# Altium project mb1260.PrjPCB (part 1 of 3)
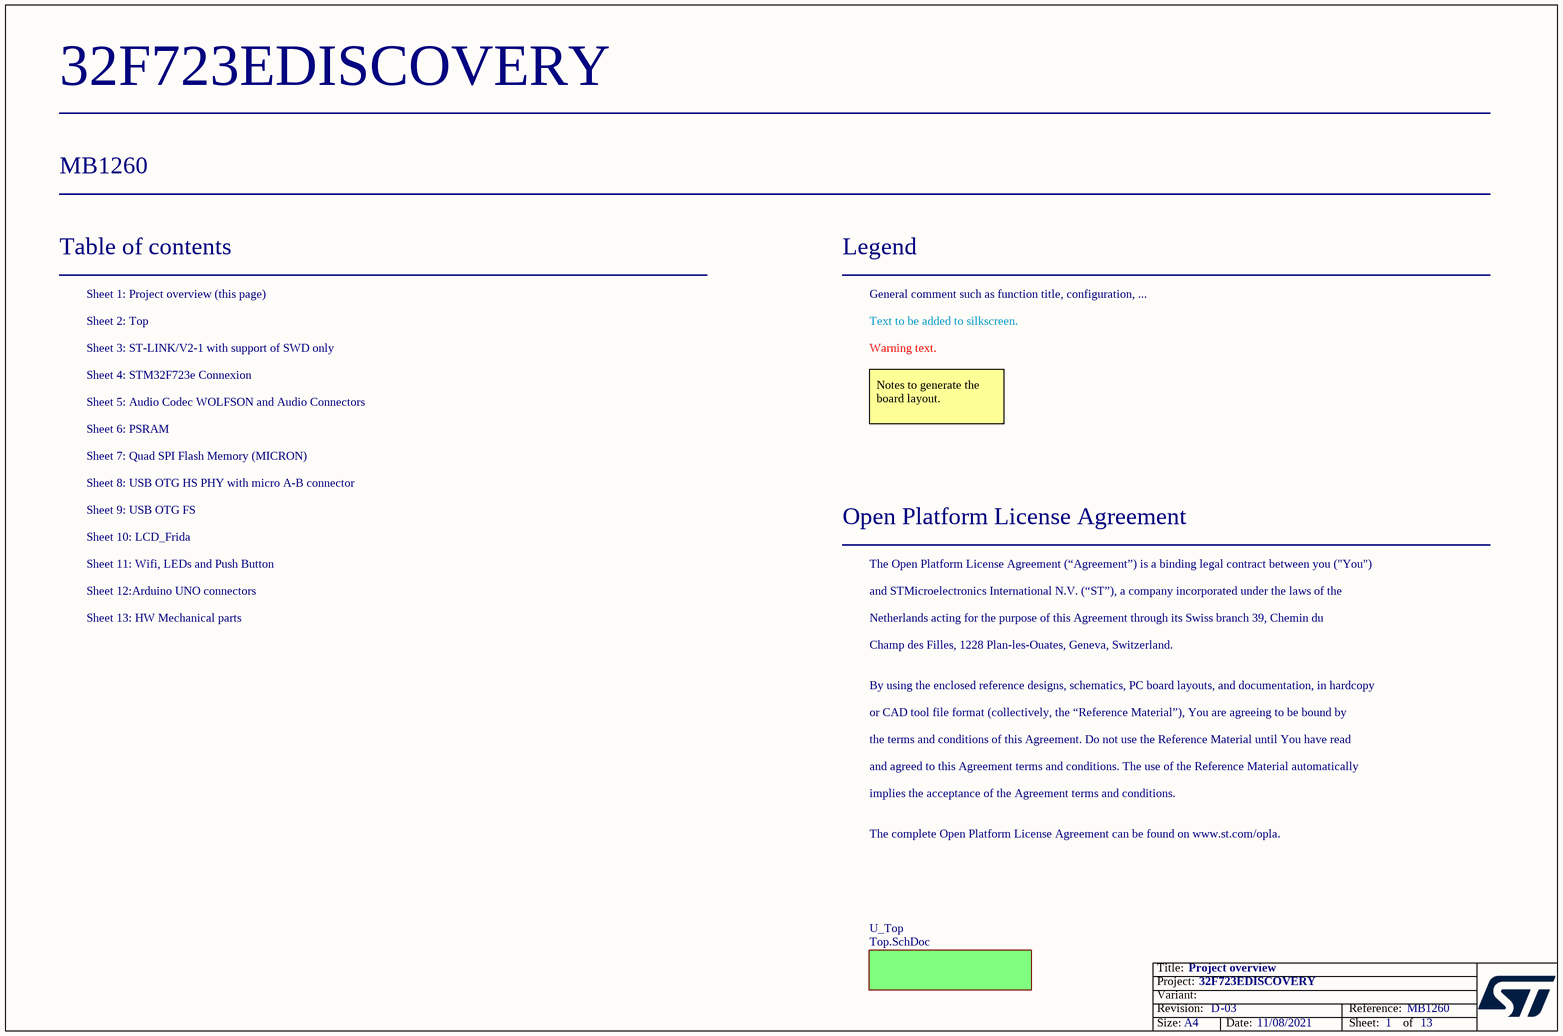
[diagram p0: Project_Overview.SchDoc]
Board_Assembly_revision: 03; Board_Document_Date: 11/08/2021; Board_name: 32F723EDISCOVERY; Board_PCB_Revision: D; Board_Reference: MB1260; BOMRevision: D-03; PCBRevision: D-03
13 sheets, 312 parts. Net scope: flat (ports and power ports of the same name join across sheets).
Board file: mb1260.PcbDoc
Sheets:
  Project_Overview.SchDoc
    U_Top = Top.SchDoc
      U_ST_LINK_V2-1 = ST_LINK_V2-1.SCHDOC
      U_AUDIO = AUDIO.SchDoc
      U_Peripherals = Peripherals.SchDoc
      U_Arduino_ Connectors = ARDUINO.SchDoc
      U_PSRAM = PSRAM.SchDoc
      U_USB_OTG_FS = USB_OTG_FS.SchDoc
      U_STM32F7 = STM32F7.SchDoc
      U_LCD_FRIDA = LCD_FRIDA.SchDoc
      U_USB_OTG_HS = USB_OTG_HS.SchDoc
      U_QSPI = QSPI.SchDoc
      U_HW_Mechanical_Parts = HW_Mechanical_Parts.SchDoc

## Sheet Project_Overview.SchDoc: Project overview
size A4; Date: Not used; ApprovedBy: Not used; CheckedBy: Not used; Author: Not used; CompanyName: STMicroelectronics; DrawnBy: Not used; Engineer: Not used; Organization: Not used; Address1: Not used; Address2: Not used; Address3: Not used; Address4: Not used; DocumentNumber: MB1260; Revision: Not used; SheetNumber: 1; SheetTotal: 13; CurrentTime: Not used; CurrentDate: Not used; Time: Not used; DocumentFullPathAndName: Not used; DocumentName: Not used; ModifiedDate: Not used; ImagePath: Not used; ProjectName: Not used; Application_BuildNumber: Not used

### Sub-sheets
U_Top = Top.SchDoc: no entries

### Notes on the sheet
- Table of contents
- Sheet 1: Project overview (this page)
- Legend
- General comment such as function title, configuration, ...
- Sheet 2: Top
- Sheet 3: ST-LINK/V2-1 with support of SWD only
- Sheet 4: STM32F723e Connexion
- Text to be added to silkscreen.
- Warning text.
- Sheet 6: PSRAM
- Sheet 5: Audio Codec WOLFSON and Audio Connectors
- Notes to generate the board layout.
- Sheet 7: Quad SPI Flash Memory (MICRON)
- Sheet 9: USB OTG FS
- Sheet 8: USB OTG HS PHY with micro A-B connector
- Sheet 10: LCD_Frida
- Sheet 11: Wifi, LEDs and Push Button
- Open Platform License Agreement
- The Open Platform License Agreement (“Agreement”) is a binding legal contract between you ("You")
- Sheet 13: HW Mechanical parts
- Sheet 12:Arduino UNO connectors
- and STMicroelectronics International N.V. (“ST”), a company incorporated under the laws of the
- Netherlands acting for the purpose of this Agreement through its Swiss branch 39, Chemin du
- Champ des Filles, 1228 Plan-les-Ouates, Geneva, Switzerland.
- By using the enclosed reference designs, schematics, PC board layouts, and documentation, in hardcopy
- or CAD tool file format (collectively, the “Reference Material”), You are agreeing to be bound by
- the terms and conditions of this Agreement. Do not use the Reference Material until You have read
- and agreed to this Agreement terms and conditions. The use of the Reference Material automatically
- implies the acceptance of the Agreement terms and conditions.
- The complete Open Platform License Agreement can be found on www.st.com/opla.
- Title:
- Project:
- Size:
- Revision:
- Variant:
- A4
- -
- Date:
- Reference:
- Sheet:
- of

## Sheet Top.SchDoc: STM32F723e Discovery Interconnexion
size A4; Author: N.P; CompanyName: STMicroelectronics; Organization: MCD/APPLIS/LMS; DocumentNumber: MB1260; Revision: D-03; SheetNumber: 2; SheetTotal: 13; Project: STM32F723e-DISCO; BOM Version: D-03
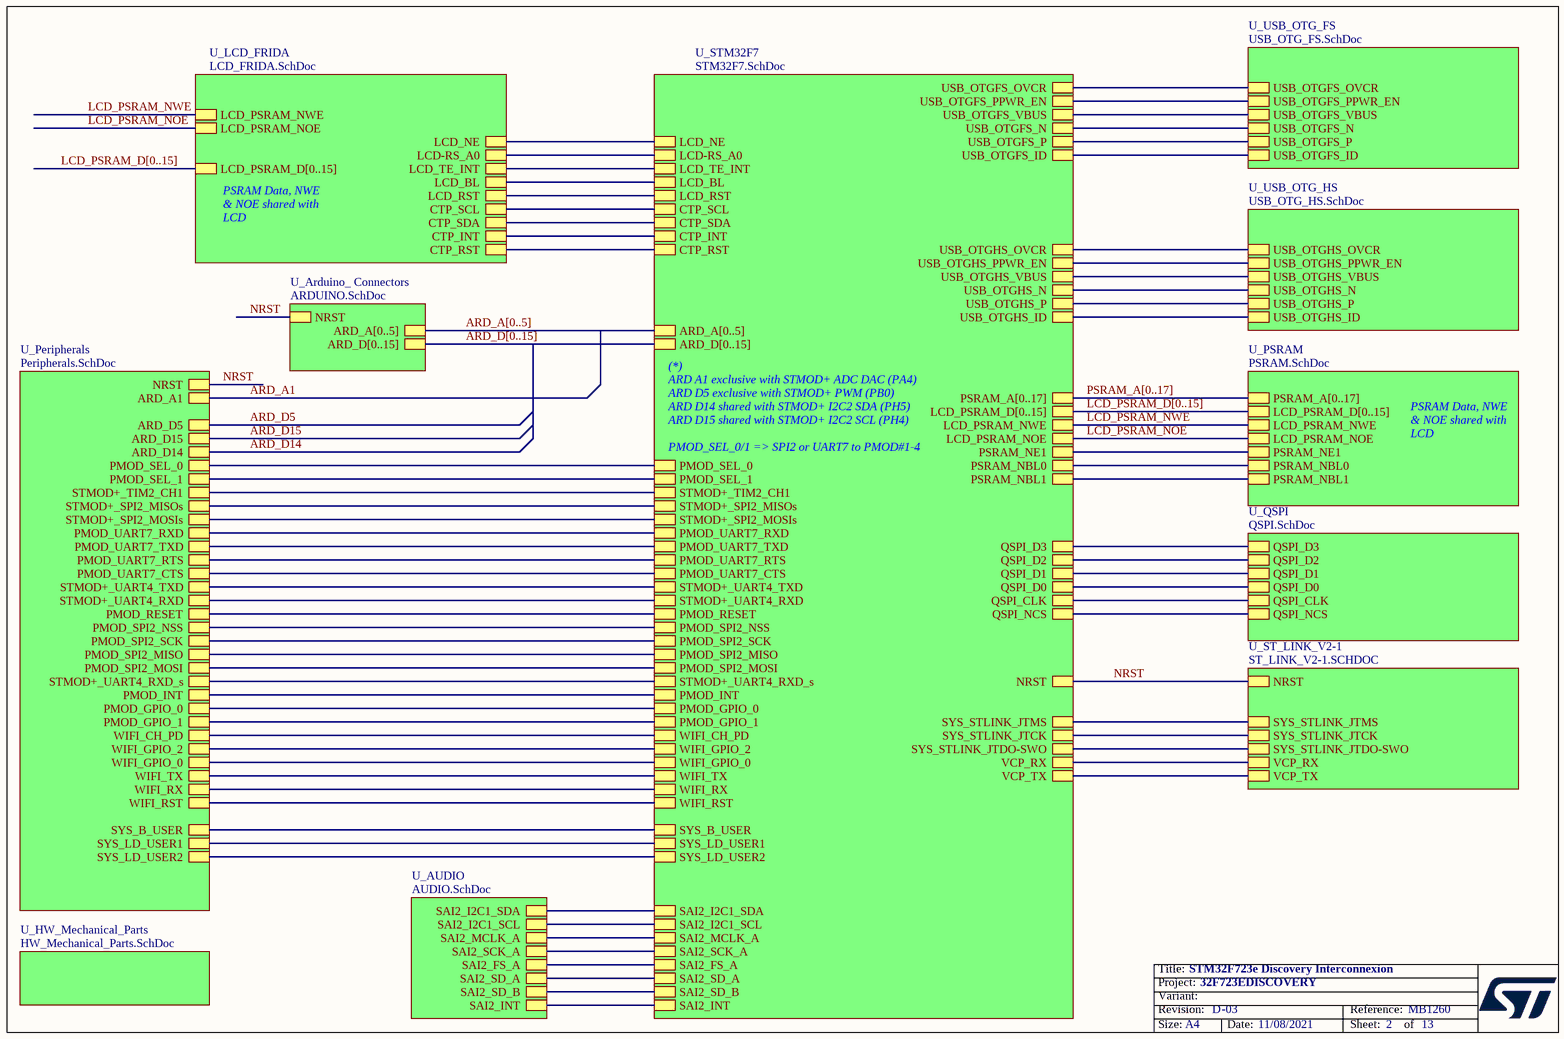
[diagram p1: Top.SchDoc]

### Sub-sheets
U_Arduino_ Connectors = ARDUINO.SchDoc: NRST, ARD_D[0..15], ARD_A[0..5]
U_AUDIO = AUDIO.SchDoc: SAI2_I2C1_SDA, SAI2_I2C1_SCL, SAI2_MCLK_A, SAI2_SCK_A, SAI2_FS_A, SAI2_SD_A, SAI2_SD_B, SAI2_INT
U_HW_Mechanical_Parts = HW_Mechanical_Parts.SchDoc: no entries
U_LCD_FRIDA = LCD_FRIDA.SchDoc: LCD_NE, LCD_TE_INT, LCD_BL, LCD_RST, CTP_SCL, CTP_SDA, CTP_INT, CTP_RST, LCD_PSRAM_D[0..15], LCD_PSRAM_NWE, LCD_PSRAM_NOE, LCD-RS_A0
U_Peripherals = Peripherals.SchDoc: NRST, WIFI_TX, WIFI_RX, WIFI_RST, STMOD+_TIM2_CH1, STMOD+_SPI2_MOSIs, PMOD_UART7_RXD, PMOD_UART7_TXD, PMOD_UART7_CTS, PMOD_UART7_RTS, STMOD+_UART4_TXD, STMOD+_UART4_RXD, PMOD_RESET, PMOD_SPI2_SCK, PMOD_SPI2_NSS, PMOD_SPI2_MISO, PMOD_SPI2_MOSI, STMOD+_UART4_RXD_s, PMOD_INT, SYS_B_USER, SYS_LD_USER1, SYS_LD_USER2, ARD_D15, ARD_D14, ARD_A1, ARD_D5, PMOD_GPIO_1, PMOD_GPIO_0, WIFI_GPIO_0, WIFI_GPIO_2, WIFI_CH_PD, PMOD_SEL_1, STMOD+_SPI2_MISOs, PMOD_SEL_0
U_PSRAM = PSRAM.SchDoc: PSRAM_A[0..17], LCD_PSRAM_D[0..15], LCD_PSRAM_NWE, PSRAM_NE1, PSRAM_NBL0, PSRAM_NBL1, LCD_PSRAM_NOE
U_QSPI = QSPI.SchDoc: QSPI_D0, QSPI_D3, QSPI_D1, QSPI_CLK, QSPI_NCS, QSPI_D2
U_ST_LINK_V2-1 = ST_LINK_V2-1.SCHDOC: SYS_STLINK_JTMS, SYS_STLINK_JTCK, SYS_STLINK_JTDO-SWO, VCP_RX, VCP_TX, NRST
U_STM32F7 = STM32F7.SchDoc: QSPI_D0, QSPI_D3, QSPI_D1, QSPI_CLK, QSPI_NCS, SAI2_I2C1_SDA, SAI2_I2C1_SCL, SAI2_MCLK_A, CTP_SCL, CTP_SDA, PSRAM_A[0..17], LCD_PSRAM_D[0..15], LCD_PSRAM_NWE, PSRAM_NE1, PSRAM_NBL0, PSRAM_NBL1, QSPI_D2, ARD_D[0..15], SAI2_SCK_A, SAI2_FS_A, SAI2_SD_A, SAI2_SD_B, SAI2_INT, LCD_NE, LCD_TE_INT, LCD_BL, LCD_RST, CTP_INT, CTP_RST, WIFI_RST, WIFI_RX, WIFI_TX, ARD_A[0..5], LCD_PSRAM_NOE, SYS_STLINK_JTMS, SYS_STLINK_JTCK, SYS_STLINK_JTDO-SWO, VCP_RX, VCP_TX, USB_OTGHS_OVCR, USB_OTGHS_PPWR_EN, USB_OTGHS_VBUS, USB_OTGHS_N, USB_OTGHS_ID, USB_OTGHS_P, USB_OTGFS_OVCR, USB_OTGFS_PPWR_EN, USB_OTGFS_VBUS, USB_OTGFS_P, USB_OTGFS_N, USB_OTGFS_ID, STMOD+_TIM2_CH1, STMOD+_SPI2_MOSIs, PMOD_UART7_RXD, PMOD_UART7_TXD, PMOD_UART7_CTS, PMOD_UART7_RTS, STMOD+_UART4_TXD, STMOD+_UART4_RXD, PMOD_RESET, PMOD_SPI2_SCK, PMOD_SPI2_NSS, PMOD_SPI2_MISO, PMOD_SPI2_MOSI, STMOD+_UART4_RXD_s, PMOD_INT, NRST, SYS_B_USER, SYS_LD_USER1, SYS_LD_USER2, PMOD_GPIO_0, PMOD_GPIO_1, WIFI_GPIO_0, WIFI_GPIO_2, WIFI_CH_PD, LCD-RS_A0, PMOD_SEL_1, STMOD+_SPI2_MISOs, PMOD_SEL_0
U_USB_OTG_FS = USB_OTG_FS.SchDoc: USB_OTGFS_OVCR, USB_OTGFS_PPWR_EN, USB_OTGFS_VBUS, USB_OTGFS_P, USB_OTGFS_N, USB_OTGFS_ID
U_USB_OTG_HS = USB_OTG_HS.SchDoc: USB_OTGHS_OVCR, USB_OTGHS_PPWR_EN, USB_OTGHS_VBUS, USB_OTGHS_N, USB_OTGHS_ID, USB_OTGHS_P

### Nets
ARD_A1: sheet U_Peripherals/ARD_A1
ARD_D5: sheet U_Peripherals/ARD_D5
ARD_D14: sheet U_Peripherals/ARD_D14
ARD_D15: sheet U_Peripherals/ARD_D15
LCD_PSRAM_NOE: sheet U_PSRAM/LCD_PSRAM_NOE, sheet U_STM32F7/LCD_PSRAM_NOE, sheet U_LCD_FRIDA/LCD_PSRAM_NOE
LCD_PSRAM_NWE: sheet U_PSRAM/LCD_PSRAM_NWE, sheet U_STM32F7/LCD_PSRAM_NWE, sheet U_LCD_FRIDA/LCD_PSRAM_NWE
NRST: sheet U_ST_LINK_V2-1/NRST, sheet U_Peripherals/NRST, sheet U_Arduino_ Connectors/NRST, sheet U_STM32F7/NRST
(unnamed): sheet U_ST_LINK_V2-1/SYS_STLINK_JTMS, sheet U_STM32F7/SYS_STLINK_JTMS
(unnamed): sheet U_ST_LINK_V2-1/SYS_STLINK_JTCK, sheet U_STM32F7/SYS_STLINK_JTCK
(unnamed): sheet U_ST_LINK_V2-1/SYS_STLINK_JTDO-SWO, sheet U_STM32F7/SYS_STLINK_JTDO-SWO
(unnamed): sheet U_ST_LINK_V2-1/VCP_RX, sheet U_STM32F7/VCP_RX
(unnamed): sheet U_ST_LINK_V2-1/VCP_TX, sheet U_STM32F7/VCP_TX
(unnamed): sheet U_AUDIO/SAI2_I2C1_SDA, sheet U_STM32F7/SAI2_I2C1_SDA
(unnamed): sheet U_AUDIO/SAI2_I2C1_SCL, sheet U_STM32F7/SAI2_I2C1_SCL
(unnamed): sheet U_AUDIO/SAI2_MCLK_A, sheet U_STM32F7/SAI2_MCLK_A
(unnamed): sheet U_AUDIO/SAI2_SCK_A, sheet U_STM32F7/SAI2_SCK_A
(unnamed): sheet U_AUDIO/SAI2_FS_A, sheet U_STM32F7/SAI2_FS_A
(unnamed): sheet U_AUDIO/SAI2_SD_A, sheet U_STM32F7/SAI2_SD_A
(unnamed): sheet U_AUDIO/SAI2_SD_B, sheet U_STM32F7/SAI2_SD_B
(unnamed): sheet U_AUDIO/SAI2_INT, sheet U_STM32F7/SAI2_INT
(unnamed): sheet U_Peripherals/WIFI_TX, sheet U_STM32F7/WIFI_TX
(unnamed): sheet U_Peripherals/WIFI_RX, sheet U_STM32F7/WIFI_RX
(unnamed): sheet U_Peripherals/WIFI_RST, sheet U_STM32F7/WIFI_RST
(unnamed): sheet U_Peripherals/STMOD+_TIM2_CH1, sheet U_STM32F7/STMOD+_TIM2_CH1
(unnamed): sheet U_Peripherals/STMOD+_SPI2_MOSIs, sheet U_STM32F7/STMOD+_SPI2_MOSIs
(unnamed): sheet U_Peripherals/PMOD_UART7_RXD, sheet U_STM32F7/PMOD_UART7_RXD
(unnamed): sheet U_Peripherals/PMOD_UART7_TXD, sheet U_STM32F7/PMOD_UART7_TXD
(unnamed): sheet U_Peripherals/PMOD_UART7_CTS, sheet U_STM32F7/PMOD_UART7_CTS
(unnamed): sheet U_Peripherals/PMOD_UART7_RTS, sheet U_STM32F7/PMOD_UART7_RTS
(unnamed): sheet U_Peripherals/STMOD+_UART4_TXD, sheet U_STM32F7/STMOD+_UART4_TXD
(unnamed): sheet U_Peripherals/STMOD+_UART4_RXD, sheet U_STM32F7/STMOD+_UART4_RXD
(unnamed): sheet U_Peripherals/PMOD_RESET, sheet U_STM32F7/PMOD_RESET
(unnamed): sheet U_Peripherals/PMOD_SPI2_SCK, sheet U_STM32F7/PMOD_SPI2_SCK
(unnamed): sheet U_Peripherals/PMOD_SPI2_NSS, sheet U_STM32F7/PMOD_SPI2_NSS
(unnamed): sheet U_Peripherals/PMOD_SPI2_MISO, sheet U_STM32F7/PMOD_SPI2_MISO
(unnamed): sheet U_Peripherals/PMOD_SPI2_MOSI, sheet U_STM32F7/PMOD_SPI2_MOSI
(unnamed): sheet U_Peripherals/STMOD+_UART4_RXD_s, sheet U_STM32F7/STMOD+_UART4_RXD_s
(unnamed): sheet U_Peripherals/PMOD_INT, sheet U_STM32F7/PMOD_INT
(unnamed): sheet U_Peripherals/SYS_B_USER, sheet U_STM32F7/SYS_B_USER
(unnamed): sheet U_Peripherals/SYS_LD_USER1, sheet U_STM32F7/SYS_LD_USER1
(unnamed): sheet U_Peripherals/SYS_LD_USER2, sheet U_STM32F7/SYS_LD_USER2
(unnamed): sheet U_Peripherals/PMOD_GPIO_1, sheet U_STM32F7/PMOD_GPIO_1
(unnamed): sheet U_Peripherals/PMOD_GPIO_0, sheet U_STM32F7/PMOD_GPIO_0
(unnamed): sheet U_Peripherals/WIFI_GPIO_0, sheet U_STM32F7/WIFI_GPIO_0
(unnamed): sheet U_Peripherals/WIFI_GPIO_2, sheet U_STM32F7/WIFI_GPIO_2
(unnamed): sheet U_Peripherals/WIFI_CH_PD, sheet U_STM32F7/WIFI_CH_PD
(unnamed): sheet U_Peripherals/PMOD_SEL_1, sheet U_STM32F7/PMOD_SEL_1
(unnamed): sheet U_Peripherals/STMOD+_SPI2_MISOs, sheet U_STM32F7/STMOD+_SPI2_MISOs
(unnamed): sheet U_Peripherals/PMOD_SEL_0, sheet U_STM32F7/PMOD_SEL_0
(unnamed): sheet U_PSRAM/PSRAM_NE1, sheet U_STM32F7/PSRAM_NE1
(unnamed): sheet U_PSRAM/PSRAM_NBL0, sheet U_STM32F7/PSRAM_NBL0
(unnamed): sheet U_PSRAM/PSRAM_NBL1, sheet U_STM32F7/PSRAM_NBL1
(unnamed): sheet U_USB_OTG_FS/USB_OTGFS_OVCR, sheet U_STM32F7/USB_OTGFS_OVCR
(unnamed): sheet U_USB_OTG_FS/USB_OTGFS_PPWR_EN, sheet U_STM32F7/USB_OTGFS_PPWR_EN
(unnamed): sheet U_USB_OTG_FS/USB_OTGFS_VBUS, sheet U_STM32F7/USB_OTGFS_VBUS
(unnamed): sheet U_USB_OTG_FS/USB_OTGFS_P, sheet U_STM32F7/USB_OTGFS_P
(unnamed): sheet U_USB_OTG_FS/USB_OTGFS_N, sheet U_STM32F7/USB_OTGFS_N
(unnamed): sheet U_USB_OTG_FS/USB_OTGFS_ID, sheet U_STM32F7/USB_OTGFS_ID
(unnamed): sheet U_STM32F7/QSPI_D0, sheet U_QSPI/QSPI_D0
(unnamed): sheet U_STM32F7/QSPI_D3, sheet U_QSPI/QSPI_D3
(unnamed): sheet U_STM32F7/QSPI_D1, sheet U_QSPI/QSPI_D1
(unnamed): sheet U_STM32F7/QSPI_CLK, sheet U_QSPI/QSPI_CLK
(unnamed): sheet U_STM32F7/QSPI_NCS, sheet U_QSPI/QSPI_NCS
(unnamed): sheet U_STM32F7/CTP_SCL, sheet U_LCD_FRIDA/CTP_SCL
(unnamed): sheet U_STM32F7/CTP_SDA, sheet U_LCD_FRIDA/CTP_SDA
(unnamed): sheet U_STM32F7/QSPI_D2, sheet U_QSPI/QSPI_D2
(unnamed): sheet U_STM32F7/LCD_NE, sheet U_LCD_FRIDA/LCD_NE
(unnamed): sheet U_STM32F7/LCD_TE_INT, sheet U_LCD_FRIDA/LCD_TE_INT
(unnamed): sheet U_STM32F7/LCD_BL, sheet U_LCD_FRIDA/LCD_BL
(unnamed): sheet U_STM32F7/LCD_RST, sheet U_LCD_FRIDA/LCD_RST
(unnamed): sheet U_STM32F7/CTP_INT, sheet U_LCD_FRIDA/CTP_INT
(unnamed): sheet U_STM32F7/CTP_RST, sheet U_LCD_FRIDA/CTP_RST
(unnamed): sheet U_STM32F7/USB_OTGHS_OVCR, sheet U_USB_OTG_HS/USB_OTGHS_OVCR
(unnamed): sheet U_STM32F7/USB_OTGHS_PPWR_EN, sheet U_USB_OTG_HS/USB_OTGHS_PPWR_EN
(unnamed): sheet U_STM32F7/USB_OTGHS_VBUS, sheet U_USB_OTG_HS/USB_OTGHS_VBUS
(unnamed): sheet U_STM32F7/USB_OTGHS_N, sheet U_USB_OTG_HS/USB_OTGHS_N
(unnamed): sheet U_STM32F7/USB_OTGHS_ID, sheet U_USB_OTG_HS/USB_OTGHS_ID
(unnamed): sheet U_STM32F7/USB_OTGHS_P, sheet U_USB_OTG_HS/USB_OTGHS_P
(unnamed): sheet U_STM32F7/LCD-RS_A0, sheet U_LCD_FRIDA/LCD-RS_A0

### Buses and harness runs
bus ARD_A[0..5] = sheet U_Arduino_ Connectors/ARD_A[0..5] = sheet U_STM32F7/ARD_A[0..5]
bus ARD_D[0..15] = sheet U_Arduino_ Connectors/ARD_D[0..15] = sheet U_STM32F7/ARD_D[0..15]
bus LCD_PSRAM_D[0..15] = sheet U_LCD_FRIDA/LCD_PSRAM_D[0..15]
bus LCD_PSRAM_D[0..15] = sheet U_PSRAM/LCD_PSRAM_D[0..15] = sheet U_STM32F7/LCD_PSRAM_D[0..15]
bus PSRAM_A[0..17] = sheet U_PSRAM/PSRAM_A[0..17] = sheet U_STM32F7/PSRAM_A[0..17]

### Notes on the sheet
- PSRAM Data, NWE & NOE shared with LCD
- (*)
  ARD A1 exclusive with STMOD+ ADC DAC (PA4)
  ARD D5 exclusive with STMOD+ PWM (PB0)
  ARD D14 shared with STMOD+ I2C2 SDA (PH5)
  ARD D15 shared with STMOD+ I2C2 SCL (PH4)
- PMOD_SEL_0/1 => SPI2 or UART7 to PMOD#1-4
- Title:
- Project:
- Size:
- Revision:
- Variant:
- A4
- -
- Date:
- Reference:
- Sheet:
- of

## Sheet ST_LINK_V2-1.SCHDOC: ST-LINK/V2-1 with support of SWD only
size A4; Author: N.P; CompanyName: STMicroelectronics; Organization: MCD/APPLIS/LMS; DocumentNumber: MB1260; Revision: D-03; SheetNumber: 3; SheetTotal: 13; Project: STM32F723e-DISCO; BOM Version: D-03
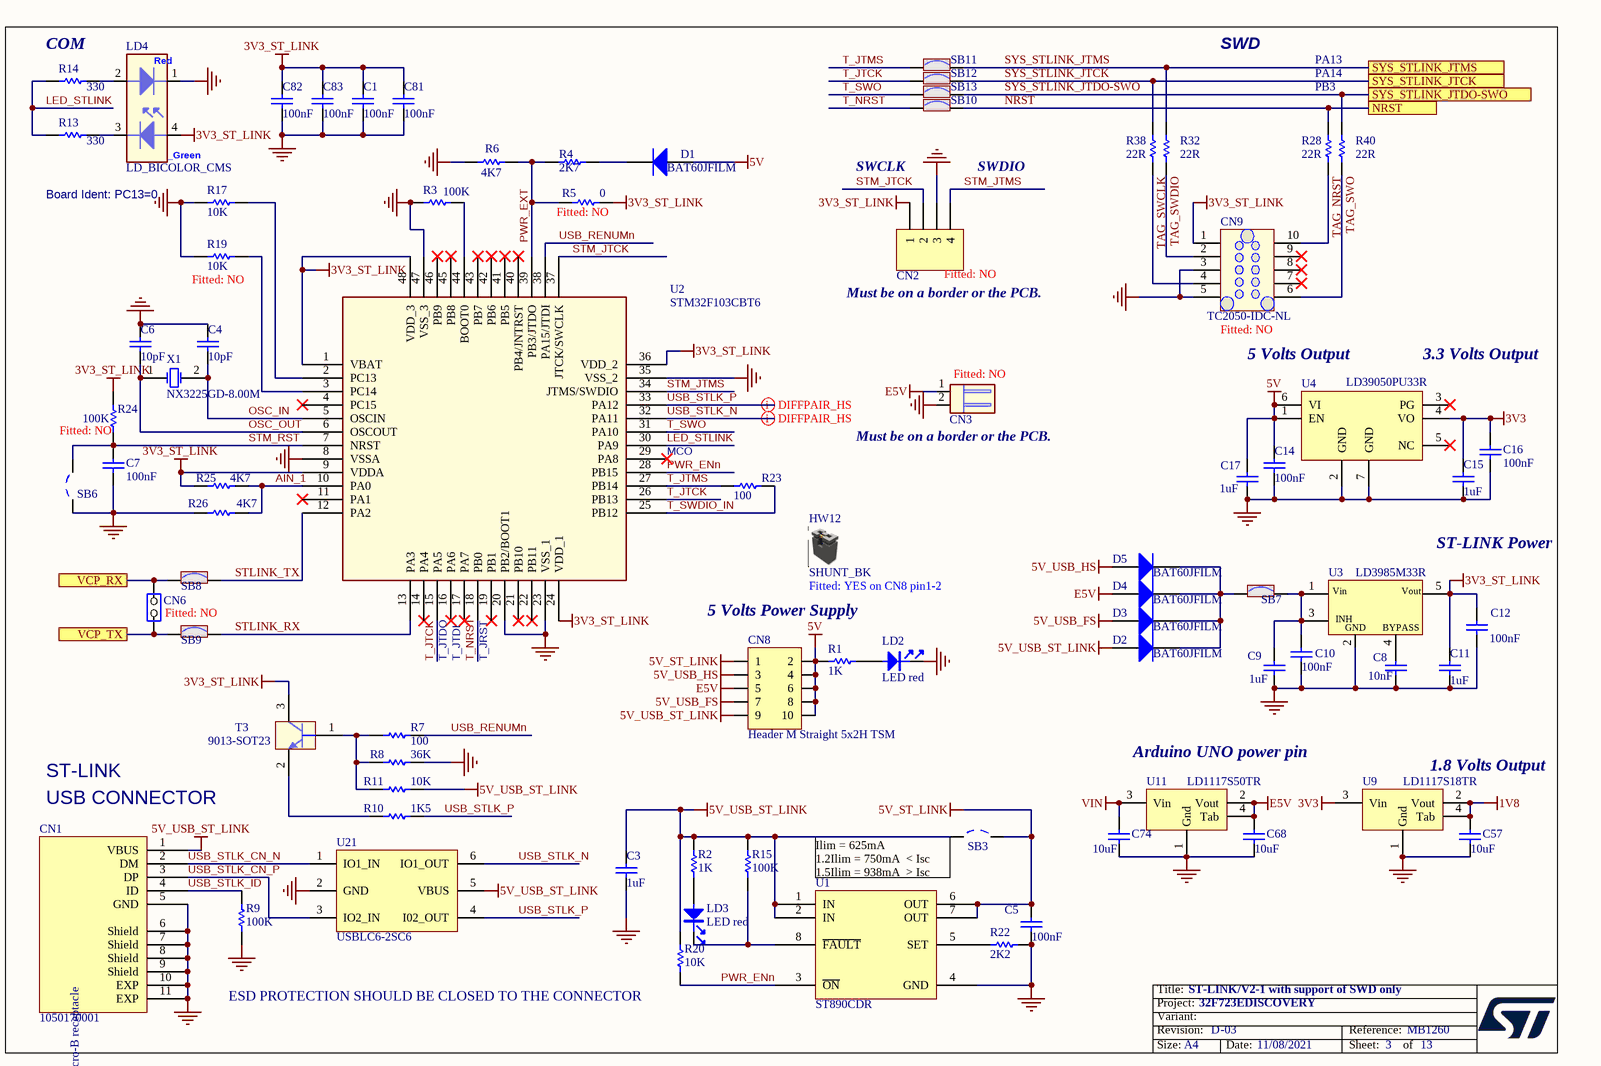
[diagram p2: ST_LINK_V2-1.SCHDOC]

### Parts
C1  100nF  [0402C]
C3  1uF  [0603C]
C4  10pF  [0402C]
C5  100nF  [0402C]
C6  10pF  [0402C]
C7  100nF  [0402C]
C8  value 10nF  [0603C]  (hidden comment: 10nF_X7R_10%_0603)
C9  1uF  [0603C]
C10  100nF  [0402C]
C11  1uF  [0603C]
C12  100nF  [0402C]
C14  100nF  [0402C]
C15  1uF  [0603C]
C16  100nF  [0402C]
C17  1uF  [0603C]
C57  10uF  [0603C]
C68  10uF  [0805C]
C74  10uF  [0805C]
C81  100nF  [0402C]
C82  100nF  [0402C]
C83  100nF  [0402C]
CN1  1050170001  [MICRO_USB_B_105017]
CN2  Fitted: NO  [HDR_1X4_2R54]  (hidden comment: Header 4)
CN3  Fitted: NO  [HDR_1X2_2R54_RA_11R35]  (hidden comment: WF25402-06421)
CN6  Fitted: NO  [SIP2]  (hidden comment: JP2)
CN8  Header M Straight 5x2H TSM  [TSM-105-01-S-DV]
CN9  TC2050-IDC-NL  Fitted: NO  [TC2050-IDC-NL]
D1  BAT60JFILM  [SOD-323]
D2  BAT60JFILM  [SOD-323]
D3  BAT60JFILM  [SOD-323]
D4  BAT60JFILM  [SOD-323]
D5  BAT60JFILM  [SOD-323]
HW12  SHUNT_BK  Fitted: YES on CN8 pin1-2  (mechanical)
LD2  LED red  [0603D]
LD3  LED red  [0603D]
LD4  LD_BICOLOR_CMS  [LED2_3528]
R1  1K  [0402R]
R2  1K  [0402R]
R3  value 100K  [0402R]  (hidden comment: 100K_1%_0402)
R4  2K7  [0402R]
R5  Fitted: NO  [0402R]  (hidden comment: 0)
R6  value 4K7  [0402R]  (hidden comment: 4K7_1%_0402)
R7  100  [0402R]
R8  36K  [0402R]
R9  value 100K  [0402R]  (hidden comment: 100K_1%_0402)
R10  1K5  [0402R]
R11  10K  [0402R]
R13  330  [0402R]
R14  330  [0402R]
R15  value 100K  [0402R]  (hidden comment: 100K_1%_0402)
R17  10K  [0402R]
R19  10K  Fitted: NO  [0402R]
R20  10K  [0402R]
R22  2K2  [0402R]
R23  100  [0402R]
R24  value 100K  Fitted: NO  [0402R]  (hidden comment: 100K_1%_0402)
R25  value 4K7  [0402R]  (hidden comment: 4K7_1%_0402)
R26  value 4K7  [0402R]  (hidden comment: 4K7_1%_0402)
R28  22R  [R0603]
R32  22R  [R0603]
R38  22R  [R0603]
R40  22R  [R0603]
SB3  Solder Bridge OFF  [JP2_SMD]  (value not drawn)
SB6  Solder Bridge OFF  [JP2_SMD]  (value not drawn)
SB7  Solder Bridge ON  [JP2_SMD]  (value not drawn)
SB8  Solder Bridge ON  [JP2_SMD]  (value not drawn)
SB9  Solder Bridge ON  [JP2_SMD]  (value not drawn)
SB10  Solder Bridge ON  [JP2_SMD]  (value not drawn)
SB11  Solder Bridge ON  [JP2_SMD]  (value not drawn)
SB12  Solder Bridge ON  [JP2_SMD]  (value not drawn)
SB13  Solder Bridge ON  [JP2_SMD]  (value not drawn)
T3  9013-SOT23  [SOT-23]
U1  ST890CDR  [SOIC8_1R27_4R9X6]
U2  STM32F103CBT6  [LQFP48_0R5_9X9]
U3  LD3985M33R  [SOT-23-5L]
U4  LD39050PU33R  [DFN6_0R95_3X3]
U9  LD1117S18TR  [SOT-223]
U11  LD1117S50TR  [SOT-223]
U21  USBLC6-2SC6  [SOT23-6]
X1  NX3225GD-8.00M  [XTAL_2SM_3R2X2R5_H1]

### Ports
NRST, SYS_STLINK_JTCK, SYS_STLINK_JTDO-SWO, SYS_STLINK_JTMS, VCP_RX, VCP_TX

### Nets
1V8: C57.2 U9.2(Vout) U9.4(Tab)
3V3: C15.2 C16.2 U4.4(VO) U9.3(Vin)
3V3_ST_LINK: C1.1 C11.2 C12.2 C81.2 C82.2 C83.2 CN2.1 CN9.1 LD4.4 R5.2 R24.2 R25.1 T3.3(C) U2.1(VBAT) U2.9(VDDA) U2.24(VDD_1) U2.36(VDD_2) U2.48(VDD_3) U3.5(Vout)
5V: C14.2 C17.2 CN8.2 CN8.4 CN8.6 CN8.8 CN8.10 D1.1(A) R1.1 U4.1(EN) U4.6(VI)
5V_ST_LINK: C5.2 CN8.1 SB3.2 U1.6(OUT) U1.7(OUT)
5V_USB_FS: CN8.7 D3.1(A)
5V_USB_HS: CN8.3 D5.1(A)
5V_USB_ST_LINK: C3.2 CN1.1(VBUS) CN8.9 D2.1(A) R2.2 R11.1 R15.2 R20.2 SB3.1 U1.1(IN) U1.2(IN) U21.5(VBUS)
E5V: C68.2 CN3.1 CN8.5 D4.1(A) U11.2(Vout) U11.4(Tab)
GND: C1.2 C3.1 C4.1 C5.1 C6.1 C7.1 C8.1 C9.1 C10.1 C11.1 C12.1 C14.1 C15.1 C16.1 C17.1 C57.1 C68.1 C74.1 C81.1 C82.1 C83.1 CN1.5(GND) CN1.6(Shield) CN1.7(Shield) CN1.8(Shield) CN1.9(Shield) CN1.10(EXP) CN1.11(EXP) CN2.3 CN3.2 CN9.3 CN9.5 LD2.2 LD4.1 R3.1 R6.1 R8.1 R9.1 R17.1 R19.1 R22.2 R26.1 SB6.1 U1.4(GND) U2.8(VSSA) U2.20(PB2/BOOT1) U2.23(VSS_1) U2.35(VSS_2) U2.47(VSS_3) U3.2(GND) U4.2(GND) U4.7(GND) U9.1(Gnd) U11.1(Gnd) U21.2(GND)
VIN: C74.2 U11.3(Vin)
AIN_1: R25.2 R26.2 U2.10(PA0)
LED_STLINK: R13.1 R14.1 U2.30(PA9)
NRST: R28.2 SB10.2 ; port NRST
OSC_IN: C4.2 U2.5(OSCIN) X1.2(OSC2)
OSC_OUT: C6.2 U2.6(OSCOUT) X1.1(OSC1)
PWR_ENn: R20.1 U1.3(~{ON}) U2.28(PB15)
PWR_EXT: R4.1 R5.1 R6.2 U2.39(PB3/JTDO)
STLINK_RX: SB9.2 U2.13(PA3)
STLINK_TX: SB8.2 U2.12(PA2)
STM_JTCK: CN2.2 U2.37(JTCK/SWCLK)
STM_JTMS: CN2.4 U2.34(JTMS/SWDIO)
STM_RST: C7.2 R24.1 SB6.2 U2.7(NRST)
SYS_STLINK_JTCK: R38.2 SB12.2 ; port SYS_STLINK_JTCK
SYS_STLINK_JTDO-SWO: R40.2 SB13.2 ; port SYS_STLINK_JTDO-SWO
SYS_STLINK_JTMS: R32.2 SB11.2 ; port SYS_STLINK_JTMS
T_JTCK: SB12.1 U2.15(PA5) U2.26(PB13)
T_JTMS: R23.1 SB11.1 U2.27(PB14)
T_NRST: SB10.1 U2.18(PB0)
T_SWDIO_IN: R23.2 U2.25(PB12)
T_SWO: SB13.1 U2.31(PA10)
TAG_NRST: CN9.10 R28.1
TAG_SWCLK: CN9.4 R38.1
TAG_SWDIO: CN9.2 R32.1
TAG_SWO: CN9.6 R40.1
USB_RENUMn: R7.2 U2.38(PA15/JTDI)
USB_STLK_CN_N: CN1.2(DM) U21.1(IO1_IN)
USB_STLK_CN_P: CN1.3(DP) U21.3(IO2_IN)
USB_STLK_ID: CN1.4(ID) R9.2
USB_STLK_N: U2.32(PA11) U21.6(IO1_OUT)
USB_STLK_P: R10.2 U2.33(PA12) U21.4(I02_OUT)
VCP_RX: CN6.2(NO) SB8.1 ; port VCP_RX
VCP_TX: CN6.1(COMMON) SB9.1 ; port VCP_TX
NetC8_2: C8.2 U3.4(BYPASS)
NetC9_2: C9.2 C10.2 SB7.2 U3.1(Vin) U3.3(CE)
NetD1_2: D1.2(K) R4.2
NetD2_2: D2.2(K) D3.2(K) D4.2(K) D5.2(K) SB7.1
NetLD2_1: LD2.1 R1.2
NetLD3_1: LD3.1 R2.1
NetLD3_2: LD3.2 R15.1 U1.8(~{FAULT})
NetLD4_2: LD4.2 R14.2
NetLD4_3: LD4.3 R13.2
NetR3_2: R3.2 U2.44(BOOT0)
NetR7_1: R7.1 R8.2 R11.2 T3.1(B)
NetR10_1: R10.1 T3.2(E)
NetR17_2: R17.2 U2.2(PC13)
NetR19_2: R19.2 U2.3(PC14)
NetR22_1: R22.1 U1.5(SET)

Not connected (* = marked no-connect by the designer): CN9 7* 8* 9*; U2 4(PC15)* 11(PA1)* 14(PA4)* 16(PA6)* 17(PA7)* 19(PB1)* 21(PB10)* 22(PB11)* 29(PA8)* 40(PB4/JNTRST)* 41(PB5)* 42(PB6)* 43(PB7)* 45(PB8)* 46(PB9)*; U4 3(PG)* 5(NC)*

### Layout directives
differential pair: USB_STLK_N, USB_STLK_P

### Notes on the sheet
- (near R14) COM
- SWD
- PA13
- PB3
- PA14
- Board Ident: PC13=0
- SWCLK
- SWDIO
- Must be on a border or the PCB.
- 5 Volts Output
- (near U4) 3.3 Volts Output
- MCO
- (near CN3) Must be on a border or the PCB.
- ST-LINK Power
- (near U2) T_JTDO
- (near U2) T_JTDI
- (near U2) T_JRST
- 5 Volts Power Supply
- ST-LINK
- (near CN1) USB CONNECTOR
- (near U11) Arduino UNO power pin
- (near U9) 1.8 Volts Output
- (near SB3) Ilim = 625mA
  1.2Ilim = 750mA  < Isc
  1.5Ilim = 938mA  > Isc
- ESD PROTECTION SHOULD BE CLOSED TO THE CONNECTOR
- Title:
- Project:
- Size:
- Revision:
- Variant:
- A4
- -
- Date:
- Reference:
- Sheet:
- of
- (in symbol 1050170001) USB_Micro-B receptacle
- (in symbol LD3985M33R) INH
- (in symbol LD_BICOLOR_CMS) Red; _Green

### Library data of the parts
C1 C5 C7 C10 C12 C14 C16 C81-C83 = Cap_100nF_X7R_10%_0402: Capacitor,100nF,16V,X7R,10%,0402,YAGEO; Manuf_Part_1: CC0402KRX7R7BB104; Ordered by: Subcon; Fitted: YES; Revision: July-2002: Re-released for DXP Platform.; Value: 100nF; Order: CC0402KRX7R7BB104; Manuf_1: YAGEO; ECCN_US/EU: n/a
C3 C9 C11 C15 C17 = Cap_1uF_X5R_10%_0603: Capacitor,1uF,16V,X5R,10%,0603,YAGEO; Manuf_Part_1: CC0603KRX5R7BB105; Ordered by: Subcon; Fitted: YES; Revision: July-2002: Re-released for DXP Platform.; Value: 1uF; Order: CC0603KRX5R7BB105; Manuf_1: YAGEO; ECCN_US/EU: n/a
C4 C6 = Cap_10pF_NPO_5%_0402: Capacitor,10pF,50V,NPO,5%,0402,YAGEO; Order: CC0402JRNPO9BN100; Ordered by: Subcon; Fitted: YES; Revision: July-2002: Re-released for DXP Platform.; Value: 10pF; Manuf_1: YAGEO; Manuf_Part_1: CC0402JRNPO9BN100; ECCN_US/EU: n/a
C8 = Cap_10nF_X7R_10%_0603: Capacitor,10nF,50V,X7R,10%,0603,YAGEO; Manuf_Part_1: CC0603KRX7R9BB103; Ordered by: Subcon; Fitted: YES; Revision: July-2002: Re-released for DXP Platform.; Order: CC0603KRX7R9BB103; Manuf_1: YAGEO; ECCN_US/EU: n/a
C57 = Cap_10uF_X5R_10%_0603: Capacitor,10uF,6.3V,X5R,10%,0603,YAGEO; Manuf_Part_1: CC0603KRX5R5BB106; Ordered by: Subcon; Fitted: YES; Revision: July-2002: Re-released for DXP Platform.; Value: 10uF; Order: CC0603KRX5R5BB106; Manuf_1: YAGEO; ECCN_US/EU: n/a
C68 C74 = Cap_10uF_X5R_10%_0805: Capacitor,10uF,25V,X5R,10%,0805,YAGEO; Manuf_Part_1: CC0805KRX5R8BB106; Ordered by: Subcon; Fitted: YES; Revision: July-2002: Re-released for DXP Platform.; Value: 10uF; Order: CC0805KRX5R8BB106; Manuf_1: YAGEO; ECCN_US/EU: n/a
CN1 = 1050170001: USB-MICRO-B, 1050170001, SMT, MOLEX; Ordered by: Subcon; Fitted: YES; ECCN_US/EU: n/a; Manuf_1: MOLEX; Manuf_Part_1: 1050170001; Distrib: DIGIKEY; SOFER_FP: MICRO_USB_B_105017
CN2 = Header 4: Header, 4-Pin; Ordered by: Subcon; Revision: 17-Jul-2002: Re-released for DXP Platform.; Publisher: Altium Limited; ECCN_US/EU: n/a; SOFER_FP: HDR_1X4_2R54
CN3 = JP2_RA: Header, 2-Pins, Single row, Right Angle, 2.54 mm pitch, DIP; Manuf_1: ATOM; Ordered by: Subcon; ECCN_US/EU: n/a; Manuf_Part_1: WF25402-06421; Distrib: SubCo
CN6 = JP2: Ordered by: Subcon; ECCN_US/EU: n/a
CN8 = Header 5X2M TSM: Header Male TSM, 5-Pin, Dual row, Straight, AMD; Manuf_Part_1: TSM-105-01-L-DV; Manuf_1: SAMTEC; Fitted: YES; Ordered by: Subcon; Distrib: Sub Co; Footprint: TSM-105-01-L-DV; ECCN_US/EU: n/a; SOFER_FP: TSM-105-01-L-DV
CN9 = Tag-10-C: Tag_Connector Header, 10-Pin, Dual row No legs; Manuf_Part_1: TC2050-IDC-NL-FP; Ordered_By: Subcon; Distrib: *; ECCN_US/EU: n/a; Manuf_1: Tag_connect; Order_code: *; Value: TC2050-IDC-NL; Ordered by: Subcon
D1-D5 = BAT60JFILM: Manuf_1: STM; Provided: ST; ECCN_US/EU: EAR99/NEC; Ref St: 9151097; Fitted: YES; Revision: July-2002: Re-released for DXP Platform.; Order: BAT60JFILM; Manuf_Part_1: BAT60JFILM; Distrib: ST; Ordered by: ST
HW12 = Shunt 2.54mm: SHUNT 2.54mm BLACK; Manuf_1: SAMTEC; Manuf_Part_1: SNT-100-BK-G; Ordered_By: Subcon; ECCN_US/EU: n/a; Distrib: *; Order_Code: *; Value: SHUNT_BK; Ordered by: Subcon
LD2 LD3 = LED_red: LED red 0603; Manuf_1: everlight; Manuf_Part_1: 19-213-R6C-AP1Q2B/3T; Ordered by: Subcon; Fitted: YES; Order: 19-213-R6C-AP1Q2B/3T; ECCN_US/EU: n/a
LD4 = LD_BICOLOR_CMS: Bicolor Led; Manuf_Part_1: 67-22VRVGC/TR8; Manuf_1: EVERLIGHT; Ordered by: Subcon; Fitted: YES
R1 R2 = Res_1K_1%_0402: Resistor,1K,0402,1%,YAGEO; Manuf_Part_1: RC0402FR-071KL; Ordered by: Subcon; Fitted: YES; Value: 1K; Manuf_1: YAGEO; Order: RC0402FR-071KL; ECCN_US/EU: n/a
R3 R9 R15 = Res_100K_1%_0402: Resistor,100K,0402,1%,YAGEO; Manuf_Part_1: RC0402FR-07100KL; Manuf_Part_2: RT0402FRE07100KL; Ordered by: Subcon; Fitted: YES; Manuf_1: YAGEO; ECCN_US/EU: n/a; Manuf_2: YAGEO
R4 = Res_2K7_1%_0402: Resistor,2K7,0402,1%,YAGEO; Manuf_Part_1: RC0402FR-072K7L; Ordered by: Subcon; Fitted: YES; Value: 2K7; Manuf_1: YAGEO; Order: RC0402FR-072K7L; ECCN_US/EU: n/a; Distrib: FARNELL
R5 = Res_0_5%_0402: Resistor,0,0402,5%,YAGEO; Manuf_Part_1: RC0402JR-070RL; Order: 2363467; Ordered by: Subcon; Value: 0; ECCN_US/EU: n/a; Manuf_1: YAGEO; Distrib: FARNELL
R6 R25 R26 = Res_4K7_1%_0402: Resistor,4K7,0402,1%,YAGEO; Manuf_Part_1: RC0402FR-074K7L; Manuf_Part_2: RT0402FRE074K7L; Ordered by: Subcon; Fitted: YES; Manuf_1: YAGEO; ECCN_US/EU: n/a; Manuf_2: YAGEO
R7 R23 = Res_100_1%_0402: Resistor,100,0402,1%,YAGEO; Manuf_Part_1: RC0402FR-07100RL; Order: 9239111; Ordered by: Subcon; Fitted: YES; Value: 100; Manuf_1: YAGEO; ECCN_US/EU: n/a; Distrib: FARNELL
R8 = Res_36K_1%_0402: Resistor,36K,0402,1%,YAGEO; Manuf_Part_1: RC0402FR-0736KL; Ordered by: Subcon; Fitted: YES; Value: 36K; Manuf_1: YAGEO; Order: RC0402FR-0736KL; ECCN_US/EU: n/a; Distrib: FARNELL
R10 = Res_1K5_1%_0402: Resistor,1K5,0402,1%,YAGEO; Manuf_Part_1: RC0402FR-071K5L; Ordered by: Subcon; Fitted: YES; Value: 1K5; Manuf_1: YAGEO; Order: RC0402FR-071K5L; ECCN_US/EU: n/a; Distrib: FARNELL
R11 R17 R20 = Res_10K_1%_0402: Resistor,10K,0402,1%,YAGEO; Manuf_Part_1: RC0402FR-0710KL; Ordered by: Subcon; Fitted: YES; Value: 10K; Manuf_1: YAGEO; Order: RC0402FR-0710KL; ECCN_US/EU: n/a
R13 R14 = Res_330_1%_0402: Resistor,330,0402,1%,YAGEO; Manuf_Part_1: RC0402FR-07330RL; Ordered by: Subcon; Fitted: YES; Value: 330; ECCN_US/EU: n/a; Manuf_1: YAGEO; Distrib: DIGIKEY; Order: RC0402FR-07330RL
R19 = Res_10K_1%_0402: Resistor,10K,0402,1%,YAGEO; Manuf_Part_1: RC0402FR-0710KL; Ordered by: Subcon; Value: 10K; Manuf_1: YAGEO; Order: RC0402FR-0710KL; ECCN_US/EU: n/a
R22 = Res_2K2_1%_0402: Resistor,2K2,0402,1%,YAGEO; Manuf_Part_1: RC0402FR-072K2L; Ordered by: Subcon; Fitted: YES; Value: 2K2; Manuf_1: YAGEO; Order: RC0402FR-072K2L; ECCN_US/EU: n/a
R24 = Res_100K_1%_0402: Resistor,100K,0402,1%,YAGEO; Manuf_Part_1: RC0402FR-07100KL; Manuf_Part_2: RT0402FRE07100KL; Ordered by: Subcon; Manuf_1: YAGEO; ECCN_US/EU: n/a; Manuf_2: YAGEO
R28 R32 R38 R40 = Res_22_1%_0603: Resistor,22R,0603,1%,Yageo; Manuf_Part_1: RC0603FR-0722RL; Fitted: YES; Ordered_By: Subcon; Value: 22R; ECCN_US/EU: n/a; Manuf_1: Yageo; Order_Code: RC0603FR-0722RL; Distrib: *; Ordered by: Subcon
SB3 SB6 = SB_OFF: Fitted: NO; Ordered by: Subcon; Revision: July-2002: Re-released for DXP Platform.; ECCN_US/EU: n/a
SB7-SB13 = SB_ON: Fitted: YES; Ordered by: Subcon; Revision: July-2002: Re-released for DXP Platform.; ECCN_US/EU: n/a
T3 = 9013-SOT23: NPN Bipolar Transistor; Manuf_1: NXP; Manuf_Part_1: BSR14; Order: 1081310; Ordered by: Subcon; Fitted: YES; Revision: July-2002: Re-released for DXP Platform.; Distrib: FARNELL; ECCN_US/EU: n/a
U1 = ST890CDR: 1.2 A current limited high-side power switch with thermal shutdown; Manuf_1: STM; ECCN_US/EU: EAR99/NEC; Provided: ST; Fitted: YES; Manuf_Part_1: ST890CDR; Distrib: ST; Footprint: SO-8; Ordered by: ST
U2 = STM32F103CBT6: Medium-density performance line ARM-based 32-bit MCU with 128KB Flash; Manuf_1: STM; Ref St: xxxxxxxx; Provided: ST; ECCN_US/EU: 3A991A2/NEC; Fitted: YES; Footprint: QFP48 7X7; Manuf_Part_1: STM32F103CBT6; Order: STM32F103CBT6; Distrib: ST; Ordered by: ST
U3 = LD3985M33R: Ultra low drop-low noise BiCMOS voltage, regulators low ESR capacitors compatible; Manuf_1: STM; Provided: ST; Ref St: 9176161; ECCN_US/EU: EAR99/NEC; Fitted: YES; Manuf_Part_1: LD3985M33R; Distrib: ST; Order: LD3985M33R; Ordered by: ST
U4 = LD39050P: Ultra low drop-low , 500 mA low quiescent current; Manuf_1: STM; Provided: ST; ECCN_US/EU: EAR99/NEC; Ref St: xxxxxxxx; Fitted: YES; Distrib: ST; Manuf_Part_1: LD39050PU33R; Order: LD39050PU33R; Ordered by: ST
U9 = LD1117S18TR: LOW DROP FIXED AND ADJUSTABLE POSITIVE VOLTAGE REGULATORS (1.8 Volts); Manuf_1: STM; Ref St: 9176180; ECCN_US/EU: EAR99/NEC; Provided: ST; Fitted: YES; Manuf_Part_1: LD1117S18TR; Order: LD1117S18TR; Distrib: ST; Ordered by: ST
U11 = LD1117S50TR: IC REG LDO 5V 0.8A SOT223; Manuf_1: STM; Ordered by: ST; ECCN_US/EU: EAR99/NEC; Ref St: 9176133; Fitted: YES; Manuf_Part_1: LD1117S50TR; Distrib: ST; Order: LD1117S50TR; Provided: ST
U21 = USBLC6-2SC6: Very low capacitance ESD protection; Manuf_1: STM; Provided: ST; ECCN_US/EU: EAR99/NEC; Fitted: YES; Manuf_Part_1: USBLC6-2SC6; Distrib: ST; Ordered by: ST
X1 = XTAL_8M_NX3225GD: Crystal 8Mhz, 8pF, -+50PPM, SMD; Manuf_1: NDK; Manuf_Part_1: NX3225GD 8MHz EXS00A-CG04874; Manuf_Part_2: NX3225GD-8.000M-STD-CRA-3; ECCN_US/EU: EAR99/NEC; NDK Ref: X3127326; Ref St: 9157029; Provided: ST; Fitted: YES; Order: NX3225GD 8MHz EXS00A-CG04874; Ordered by: ST

## Sheet AUDIO.SchDoc: Audio Codec WOLFSON and Audio Connectors
size A4; Author: N.P; CompanyName: STMicroelectronics; Organization: MCD/APPLIS/LMS; DocumentNumber: MB1260; Revision: D-03; SheetNumber: 5; SheetTotal: 13; Project: STM32F723e-DISCO; BOM Version: D-03
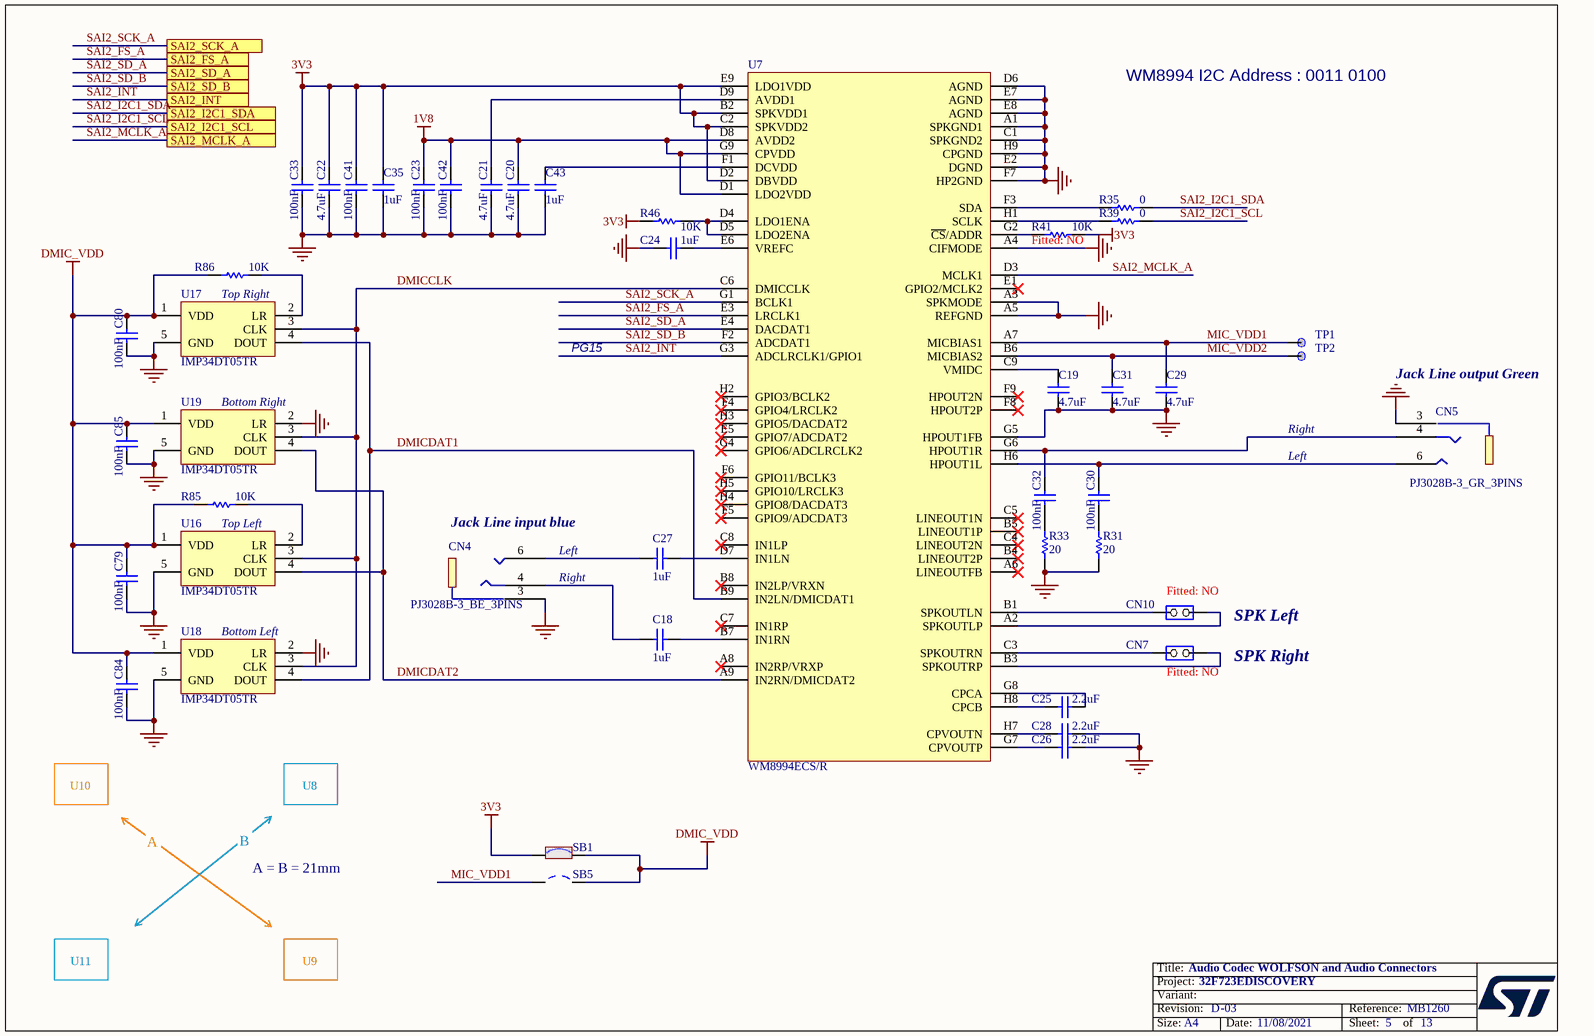
[diagram p3: AUDIO.SchDoc]

### Parts
C18  1uF  [0603C]
C19  4.7uF  [0603C]
C20  4.7uF  [0603C]
C21  4.7uF  [0603C]
C22  4.7uF  [0603C]
C23  100nF  [0402C]
C24  1uF  [0603C]
C25  value 2.2uF  [0603C]  (hidden comment: 2.2uF_X5R_10%_0603)
C26  value 2.2uF  [0603C]  (hidden comment: 2.2uF_X5R_10%_0603)
C27  1uF  [0603C]
C28  value 2.2uF  [0603C]  (hidden comment: 2.2uF_X5R_10%_0603)
C29  4.7uF  [0603C]
C30  100nF  [0402C]
C31  4.7uF  [0603C]
C32  100nF  [0402C]
C33  100nF  [0402C]
C35  1uF  [0603C]
C41  100nF  [0402C]
C42  100nF  [0402C]
C43  1uF  [0603C]
C79  100nF  [0402C]
C80  100nF  [0402C]
C84  100nF  [0402C]
C85  100nF  [0402C]
CN4  PJ3028B-3_BE_3PINS  [PJ3028B]
CN5  PJ3028B-3_GR_3PINS  [PJ3028B]
CN7  Fitted: NO  [SIP2]  (hidden comment: JP2)
CN10  Fitted: NO  [SIP2]  (hidden comment: JP2)
R31  20  [0402R]
R33  20  [0402R]
R35  0  [0402R]
R39  0  [0402R]
R41  Fitted: NO  [0402R]  (hidden comment: 10K)
R46  10K  [0402R]
R85  10K  [0402R]
R86  10K  [0402R]
SB1  Solder Bridge ON  [JP2_SMD]  (value not drawn)
SB5  Solder Bridge OFF  [JP2_SMD]  (value not drawn)
TP1  TP  [TP_C40]  (value not drawn)
TP2  TP  [TP_C40]  (value not drawn)
U7  WM8994ECS/R  [BGA72_0R5_4R5X4]
U16  IMP34DT05TR  [MP34DT01TR]
U17  IMP34DT05TR  [MP34DT01TR]
U18  IMP34DT05TR  [MP34DT01TR]
U19  IMP34DT05TR  [MP34DT01TR]

### Ports
SAI2_FS_A, SAI2_I2C1_SCL, SAI2_I2C1_SDA, SAI2_INT, SAI2_MCLK_A, SAI2_SCK_A, SAI2_SD_A, SAI2_SD_B

### Nets
1V8: C20.1 C23.1 C42.1 U7.D1(LDO2VDD) U7.D8(AVDD2) U7.G9(CPVDD)
3V3: C22.1 C33.1 C35.2 C41.1 R41.1 R46.2 SB1.1 U7.B2(SPKVDD1) U7.C2(SPKVDD2) U7.D2(DBVDD) U7.E9(LDO1VDD)
DMIC_VDD: C79.1 C80.1 C84.1 C85.1 R85.2 R86.2 SB1.2 SB5.2 U16.1(VDD) U17.1(VDD) U18.1(VDD) U19.1(VDD)
GND: C19.1 C20.2 C21.2 C22.2 C23.2 C24.2 C26.2 C28.2 C29.1 C31.1 C33.2 C35.1 C41.2 C42.2 C43.1 C79.2 C80.2 C84.2 C85.2 CN4.3 CN5.3 R31.2 R33.2 U7.A1(SPKGND1) U7.A3(SPKMODE) U7.A4(CIFMODE) U7.A5(REFGND) U7.C1(SPKGND2) U7.D6(AGND) U7.E2(DGND) U7.E7(AGND) U7.E8(AGND) U7.F7(HP2GND) U7.G5(HPOUT1FB) U7.H9(CPGND) U16.5(GND) U17.5(GND) U18.2(LR) U18.5(GND) U19.2(LR) U19.5(GND)
DMICCLK: U7.C6(DMICCLK) U16.3(CLK) U17.3(CLK) U18.3(CLK) U19.3(CLK)
DMICDAT1: U7.B9(IN2LN/DMICDAT1) U17.4(DOUT) U18.4(DOUT)
DMICDAT2: U7.A9(IN2RN/DMICDAT2) U16.4(DOUT) U19.4(DOUT)
MIC_VDD1: C29.2 SB5.1 TP1.1 U7.A7(MICBIAS1)
MIC_VDD2: C31.2 TP2.1 U7.B6(MICBIAS2)
SAI2_FS_A: U7.E3(LRCLK1) ; port SAI2_FS_A
SAI2_I2C1_SCL: R39.1 ; port SAI2_I2C1_SCL
SAI2_I2C1_SDA: R35.1 ; port SAI2_I2C1_SDA
SAI2_INT: U7.G3(ADCLRCLK1/GPIO1) ; port SAI2_INT
SAI2_MCLK_A: U7.D3(MCLK1) ; port SAI2_MCLK_A
SAI2_SCK_A: U7.G1(BCLK1) ; port SAI2_SCK_A
SAI2_SD_A: U7.E4(DACDAT1) ; port SAI2_SD_A
SAI2_SD_B: U7.F2(ADCDAT1) ; port SAI2_SD_B
NetC18_1: C18.1 U7.B7(IN1RN)
NetC18_2: C18.2 CN4.4
NetC19_2: C19.2 U7.C9(VMIDC)
NetC21_1: C21.1 U7.D9(AVDD1)
NetC24_1: C24.1 U7.E6(VREFC)
NetC25_1: C25.1 U7.H8(CPCB)
NetC25_2: C25.2 U7.G8(CPCA)
NetC26_1: C26.1 U7.G7(CPVOUTP)
NetC27_1: C27.1 U7.D7(IN1LN)
NetC27_2: C27.2 CN4.6
NetC28_1: C28.1 U7.H7(CPVOUTN)
NetC30_1: C30.1 CN5.6 U7.H6(HPOUT1L)
NetC30_2: C30.2 R31.1
NetC32_1: C32.1 CN5.4 U7.G6(HPOUT1R)
NetC32_2: C32.2 R33.1
NetC43_2: C43.2 U7.F1(DCVDD)
NetCN7_1: CN7.1(COMMON) U7.C3(SPKOUTRN)
NetCN7_2: CN7.2(NO) U7.B3(SPKOUTRP)
NetCN10_1: CN10.1(COMMON) U7.B1(SPKOUTLN)
NetCN10_2: CN10.2(NO) U7.A2(SPKOUTLP)
NetR35_2: R35.2 U7.F3(SDA)
NetR39_2: R39.2 U7.H1(SCLK)
NetR41_2: R41.2 U7.G2(~{CS}/ADDR)
NetR46_1: R46.1 U7.D4(LDO1ENA) U7.D5(LDO2ENA)
NetR85_1: R85.1 U16.2(LR)
NetR86_1: R86.1 U17.2(LR)

Not connected (* = marked no-connect by the designer): U7 A6(LINEOUTFB)* A8(IN2RP/VRXP)* B4(LINEOUT2P)* B5(LINEOUT1P)* B8(IN2LP/VRXN)* C4(LINEOUT2N)* C5(LINEOUT1N)* C7(IN1RP)* C8(IN1LP)* E1(GPIO2/MCLK2)* E5(GPIO7/ADCDAT2)* F4(GPIO4/LRCLK2)* F5(GPIO9/ADCDAT3)* F6(GPIO11/BCLK3)* F8(HPOUT2P)* F9(HPOUT2N)* G4(GPIO6/ADCLRCLK2)* H2(GPIO3/BCLK2)* H3(GPIO5/DACDAT2)* H4(GPIO8/DACDAT3)* H5(GPIO10/LRCLK3)*

### Notes on the sheet
- WM8994 I2C Address : 0011 0100
- Top Right
- PG15
- (near CN5) Jack Line output Green
- (near U19) Bottom Right
- Right
- Left
- Top Left
- (near CN4) Jack Line input blue
- (near U18) Bottom Left
- SPK Left
- SPK Right
- U10
- A
- B
- U8
- A = B = 21mm
- U11
- U9
- Title:
- Project:
- Size:
- Revision:
- Variant:
- A4
- -
- Date:
- Reference:
- Sheet:
- of

### Library data of the parts
C18 C24 C27 C35 C43 = Cap_1uF_X5R_10%_0603: as C3 on sheet ST_LINK_V2-1; Revision: July-2002: Re-released for DXP Platform.; Value: 1uF; Order: CC0603KRX5R7BB105; Manuf_1: YAGEO; ECCN_US/EU: n/a
C19-C22 C29 C31 = Cap_4.7uF_X5R_10%_0603: Capacitor,4.7uF,16V, X5R,10%,0603,YAGEO; Manuf_Part_1: CC0603KRX5R7BB475; Order: CC0603KRX5R7BB105; Ordered by: Subcon; Fitted: YES; Revision: July-2002: Re-released for DXP Platform.; Value: 4.7uF; Manuf_1: YAGEO; ECCN_US/EU: n/a
C23 C30 C32 C33 C41 C42 C79 C80 C84 C85 = Cap_100nF_X7R_10%_0402: as C1 on sheet ST_LINK_V2-1; Revision: July-2002: Re-released for DXP Platform.; Value: 100nF; Order: CC0402KRX7R7BB104; Manuf_1: YAGEO; ECCN_US/EU: n/a
C25 C26 C28 = Cap_2.2uF_X5R_10%_0603: Capacitor,2.2uF,10V, X5R,10%,0603,YAGEO; Manuf_Part_1: CC0603KRX5R6BB225; Manuf_Part_2: C0603C225K8PACTU; Manuf_2: KEMET; Ordered by: Subcon; Fitted: YES; Revision: July-2002: Re-released for DXP Platform.; Order: *; Manuf_1: YAGEO; ECCN_US/EU: n/a
CN4 = PJ3028B-3_BE_3PINS: Connector Jack Stereo 3.5mm, female SMT, Blue (Line input); Manuf_Part_2: PJ30280-3_BE; Ordered by: Subcon; Fitted: YES; ECCN_US/EU: n/a; Manuf_Part_1: PJ3028B-3_BE; Manuf_1: http://ww.qiaod.com
CN5 = PJ3028B-3_GR_3PINS: Connector Jack Stereo 3.5mm, female SMT, Green (Line output); Manuf_Part_2: PJ30280-3_GR; Ordered by: Subcon; Fitted: YES; ECCN_US/EU: n/a; Manuf_Part_1: PJ3028B-3_GR; Manuf_1: http://ww.qiaod.com
CN7 CN10 = JP2: Ordered by: Subcon; ECCN_US/EU: n/a
R31 R33 = Res_20_1%_0402: Resistor,20,0402,1%,YAGEO; Manuf_Part_1: RC0402FR-0720RL; Ordered by: Subcon; Fitted: YES; Value: 20; Manuf_1: YAGEO; Order: *; ECCN_US/EU: n/a
R35 R39 = Res_0_5%_0402: Resistor,0,0402,5%,YAGEO; Manuf_Part_1: RC0402JR-070RL; Order: 2363467; Ordered by: Subcon; Fitted: YES; Value: 0; ECCN_US/EU: n/a; Manuf_1: YAGEO; Distrib: FARNELL
R41 = Res_10K_1%_0402: as R19 on sheet ST_LINK_V2-1; Value: 10K; Manuf_1: YAGEO; Order: RC0402FR-0710KL; ECCN_US/EU: n/a
R46 R85 R86 = Res_10K_1%_0402: as R11 on sheet ST_LINK_V2-1; Value: 10K; Manuf_1: YAGEO; Order: RC0402FR-0710KL; ECCN_US/EU: n/a
SB1 = SB_ON: Fitted: YES; Ordered by: Subcon; Revision: July-2002: Re-released for DXP Platform.; ECCN_US/EU: n/a
SB5 = SB_OFF: Fitted: NO; Ordered by: Subcon; Revision: July-2002: Re-released for DXP Platform.; ECCN_US/EU: n/a
TP1 TP2 = TP: Test Point; Fitted: NO; Ordered by: Subcon; ECCN_US/EU: n/a
U7 = WM8994ECS/R: Multi-Channel Audio Hub CODEC for Smartphones; Manuf_1: Cirrus Logic; Ordered by: Subcon; Fitted: YES; Manuf_Part_1: WM8994ECS/R; Distrib: Cirrus Logic; ECCN_US/EU: n/a
U16-U19 = MP34DT01: MEMS audio sensor, omnidirectional digital microphone; Manuf_1: STM; Provided: ST; Fitted: YES; Manuf_Part_1: IMP34DT05TR; Order: IMP34DT05TR; Distrib: ST; Ordered by: ST

## Sheet Peripherals.SchDoc: Wifi, LEDs and Push Button
size A4; Author: N.P; CompanyName: STMicroelectronics; Organization: MCD/APPLIS/LMS; DocumentNumber: MB1260; Revision: D-03; SheetNumber: 11; SheetTotal: 13; Project: STM32F723e-DISCO; BOM Version: D-03
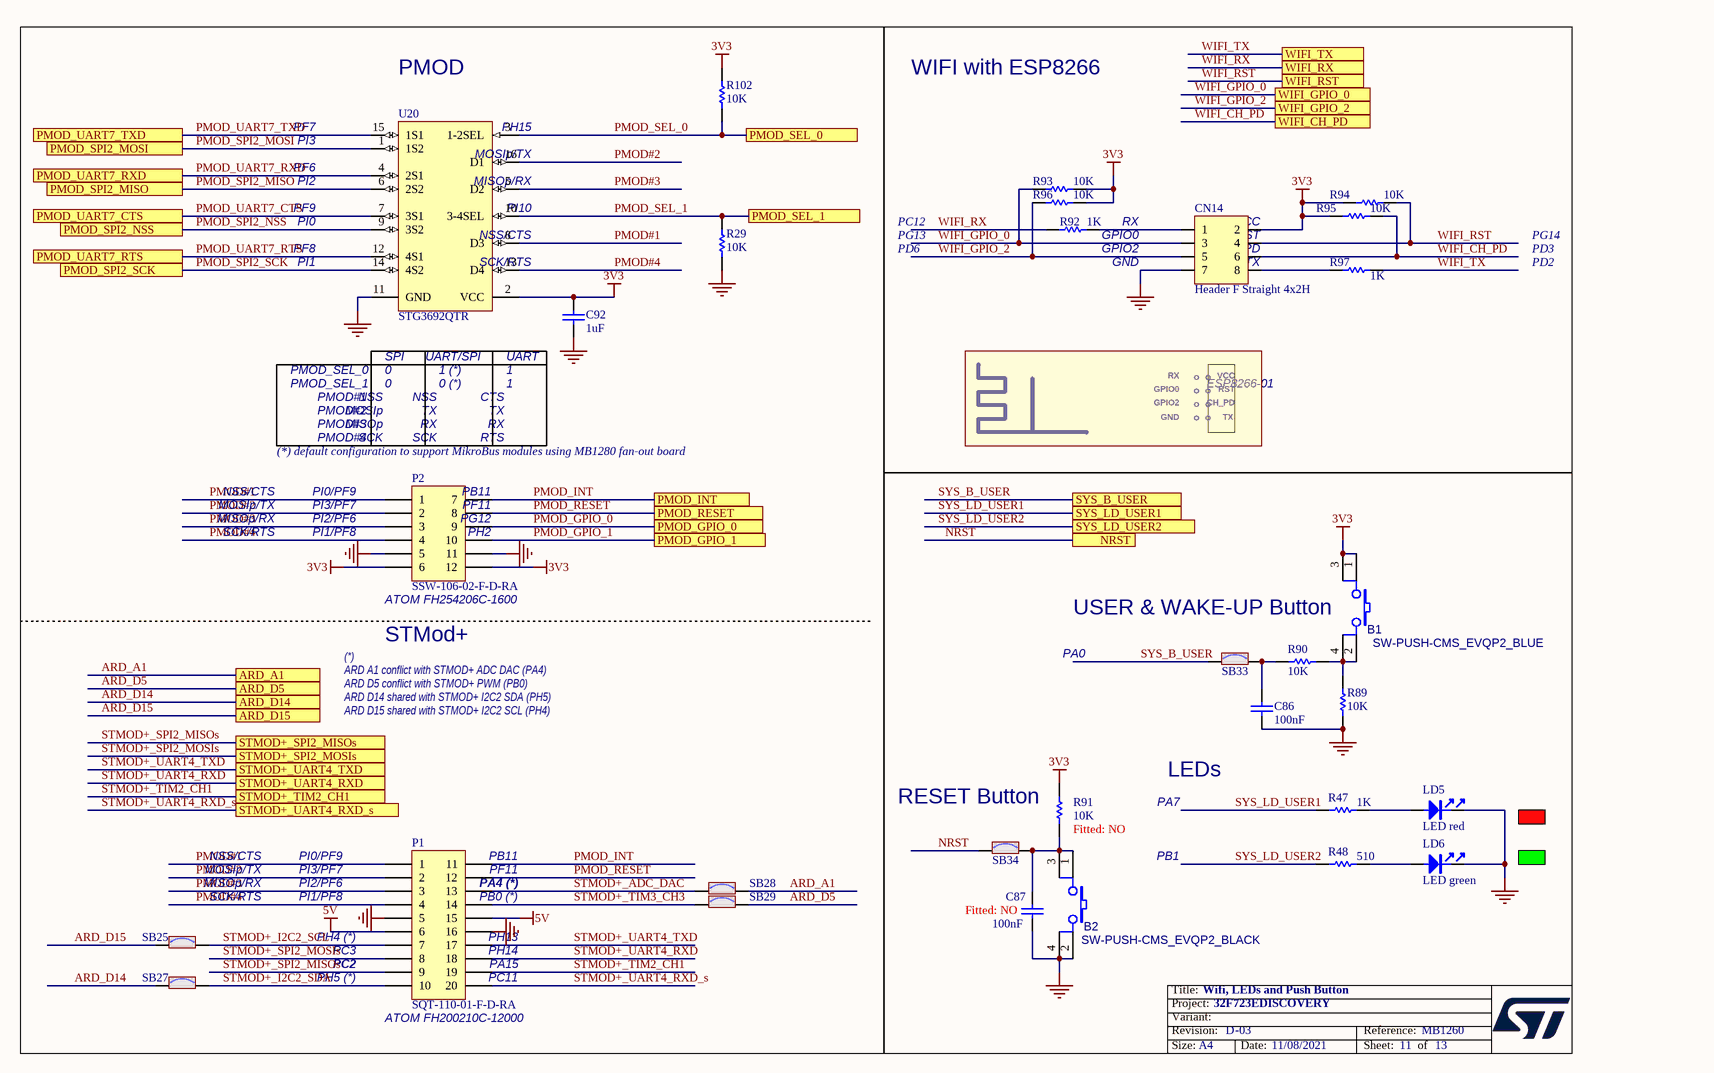
[diagram p4: Peripherals.SchDoc]

### Parts
B1  SW-PUSH-CMS_EVQP2_BLUE  [TACT_4SM_3R5X5R5]
B2  SW-PUSH-CMS_EVQP2_BLACK  [TACT_4SM_3R5X5R5]
C86  100nF  [0402C]
C87  100nF  Fitted: NO  [0402C]
C92  1uF  [0603C]
CN14  Header F Straight 4x2H  [HDR_2X4_2R54]
LD5  LED red  [0603D]
LD6  LED green  [0603D]
P1  SQT-110-01-F-D-RA  [SQT-110-01-F-D-RA]
P2  SSW-106-02-F-D-RA  [SSW-106-02-F-D-RA]
R29  10K  [0402R]
R47  value 1K  [0603R]  (hidden comment: 1K_1%_0603)
R48  value 510  [0603R]  (hidden comment: 510_1%_0603)
R89  10K  [0402R]
R90  10K  [0402R]
R91  Fitted: NO  [0402R]  (hidden comment: 10K)
R92  1K  [0402R]
R93  10K  [0402R]
R94  10K  [0402R]
R95  10K  [0402R]
R96  10K  [0402R]
R97  1K  [0402R]
R102  10K  [0402R]
SB25  Solder Bridge ON  [JP2_SMD]  (value not drawn)
SB27  Solder Bridge ON  [JP2_SMD]  (value not drawn)
SB28  Solder Bridge ON  [JP2_SMD]  (value not drawn)
SB29  Solder Bridge ON  [JP2_SMD]  (value not drawn)
SB33  Solder Bridge ON  [JP2_SMD]  (value not drawn)
SB34  Solder Bridge ON  [JP2_SMD]  (value not drawn)
U20  STG3692QTR  [QFN16_0R4_2R5X1R7]

### Ports
ARD_A1, ARD_D5, ARD_D14, ARD_D15, NRST, PMOD_GPIO_0, PMOD_GPIO_1, PMOD_INT, PMOD_RESET, PMOD_SEL_0, PMOD_SEL_1, PMOD_SPI2_MISO, PMOD_SPI2_MOSI, PMOD_SPI2_NSS, PMOD_SPI2_SCK, PMOD_UART7_CTS, PMOD_UART7_RTS, PMOD_UART7_RXD, PMOD_UART7_TXD, STMOD+_SPI2_MISOs, STMOD+_SPI2_MOSIs, STMOD+_TIM2_CH1, STMOD+_UART4_RXD, STMOD+_UART4_RXD_s, STMOD+_UART4_TXD, SYS_B_USER, SYS_LD_USER1, SYS_LD_USER2, WIFI_CH_PD, WIFI_GPIO_0, WIFI_GPIO_2, WIFI_RST, WIFI_RX, WIFI_TX

### Nets
3V3: B1.1 B1.3 C92.1 CN14.2 P2.6 P2.12 R91.2 R93.1 R94.1 R95.1 R96.1 R102.2 U20.2(VCC)
5V: P1.6 P1.15
GND: B2.2 B2.4 C86.1 C87.1 C92.2 CN14.7 LD5.2 LD6.2 P1.5 P1.16 P2.5 P2.11 R29.1 R89.1 U20.11(GND)
ARD_A1: SB28.2 ; port ARD_A1
ARD_D5: SB29.2 ; port ARD_D5
ARD_D14: SB27.1 ; port ARD_D14
ARD_D15: SB25.1 ; port ARD_D15
NRST: SB34.1 ; port NRST
PMOD#1: P1.1 P2.1 U20.8(D3)
PMOD#2: P1.2 P2.2 U20.16(D1)
PMOD#3: P1.3 P2.3 U20.5(D2)
PMOD#4: P1.4 P2.4 U20.13(D4)
PMOD_GPIO_0: P2.9 ; port PMOD_GPIO_0
PMOD_GPIO_1: P2.10 ; port PMOD_GPIO_1
PMOD_INT: P1.11 P2.7 ; port PMOD_INT
PMOD_RESET: P1.12 P2.8 ; port PMOD_RESET
PMOD_SEL_0: R102.1 U20.3(1-2SEL) ; port PMOD_SEL_0
PMOD_SEL_1: R29.2 U20.10(3-4SEL) ; port PMOD_SEL_1
PMOD_SPI2_MISO: U20.6(2S2) ; port PMOD_SPI2_MISO
PMOD_SPI2_MOSI: U20.1(1S2) ; port PMOD_SPI2_MOSI
PMOD_SPI2_NSS: U20.9(3S2) ; port PMOD_SPI2_NSS
PMOD_SPI2_SCK: U20.14(4S2) ; port PMOD_SPI2_SCK
PMOD_UART7_CTS: U20.7(3S1) ; port PMOD_UART7_CTS
PMOD_UART7_RTS: U20.12(4S1) ; port PMOD_UART7_RTS
PMOD_UART7_RXD: U20.4(2S1) ; port PMOD_UART7_RXD
PMOD_UART7_TXD: U20.15(1S1) ; port PMOD_UART7_TXD
STMOD+_ADC_DAC: P1.13 SB28.1
STMOD+_I2C2_SCL: P1.7 SB25.2
STMOD+_I2C2_SDA: P1.10 SB27.2
STMOD+_SPI2_MISOs: P1.9 ; port STMOD+_SPI2_MISOs
STMOD+_SPI2_MOSIs: P1.8 ; port STMOD+_SPI2_MOSIs
STMOD+_TIM2_CH1: P1.19 ; port STMOD+_TIM2_CH1
STMOD+_TIM3_CH3: P1.14 SB29.1
STMOD+_UART4_RXD: P1.18 ; port STMOD+_UART4_RXD
STMOD+_UART4_RXD_s: P1.20 ; port STMOD+_UART4_RXD_s
STMOD+_UART4_TXD: P1.17 ; port STMOD+_UART4_TXD
SYS_B_USER: SB33.1 ; port SYS_B_USER
SYS_LD_USER1: R47.1 ; port SYS_LD_USER1
SYS_LD_USER2: R48.1 ; port SYS_LD_USER2
WIFI_CH_PD: CN14.6 R95.2 ; port WIFI_CH_PD
WIFI_GPIO_0: CN14.3 R93.2 ; port WIFI_GPIO_0
WIFI_GPIO_2: CN14.5 R96.2 ; port WIFI_GPIO_2
WIFI_RST: CN14.4 R94.2 ; port WIFI_RST
WIFI_RX: R92.1 ; port WIFI_RX
WIFI_TX: R97.2 ; port WIFI_TX
NetB1_2: B1.2 B1.4 R89.2 R90.2
NetB2_1: B2.1 B2.3 C87.2 R91.1 SB34.2
NetC86_2: C86.2 R90.1 SB33.2
NetCN14_1: CN14.1 R92.2
NetCN14_8: CN14.8 R97.1
NetLD5_1: LD5.1 R47.2
NetLD6_1: LD6.1 R48.2

### Notes on the sheet
- PF7
- PMOD
- (near U20) PH15
- WIFI with ESP8266
- PI3
- PF6
- PI2
- (near U20) MOSIp/TX
- (near U20) MISOp/RX
- PF9
- PI1
- PI0
- PF8
- (near U20) PI10
- (near U20) NSS/CTS
- SCK/RTS
- PC12
- PG13
- PD6
- (near CN14) GND
- (near CN14) GPIO2
- (near CN14) GPIO0
- RX
- (near CN14) VCC
- (near CN14) CH_PD
- (near CN14) RST
- (near CN14) TX
- PG14
- PD3
- PD2
- PMOD_SEL_0
- PMOD_SEL_1
- PMOD#1
- 0
- NSS
- SPI
- UART/SPI
- 0 (*)
- 1 (*)
- CTS
- UART
- 1
- GPIO2
- GPIO0
- ° °
- VCC
- CH_PD
- RST
- ESP8266-01
- (near P2) (*) default configuration to support MikroBus modules using MB1280 fan-out board
- PMOD#2
- PMOD#3
- PMOD#4
- MOSIp
- MISOp
- SCK
- TX
- RTS
- GND
- NSS/CTS
- MOSIp/TX
- MISOp/RX
- (near P2) PI0/PF9
- (near P2) PI3/PF7
- (near P2) PI2/PF6
- (near P2) PI1/PF8
- (near P2) PB11
- (near P2) PF11
- (near P2) PG12
- (near P2) PH2
- (near P2) ATOM FH254206C-1600
- STMod+
- USER & WAKE-UP Button
- PA0
- (*)
  ARD A1 conflict with STMOD+ ADC DAC (PA4)
  ARD D5 conflict with STMOD+ PWM (PB0)
  ARD D14 shared with STMOD+ I2C2 SDA (PH5)
  ARD D15 shared with STMOD+ I2C2 SCL (PH4)
- RESET Button
- LEDs
- PA7
- (near P1) PI0/PF9
- (near P1) PI3/PF7
- PB11
- PF11
- PB1
- (near P1) PI2/PF6
- (near P1) PI1/PF8
- (near P1) PH4 (*)
- PA4 (*)
- PB0 (*)
- PH13
- (near P1) PC3
- (near P1) PC2
- (near P1) PH5 (*)
- PH14
- PA15
- PC11
- (near P1) ATOM FH200210C-12000
- Title:
- Project:
- Size:
- Revision:
- Variant:
- A4
- -
- Date:
- Reference:
- Sheet:
- of

### Library data of the parts
B1 = SW-PUSH-CMS_EVQP2_BLUE: EVQP2 - 4.7mm x 3.5 mm SMD Light Touch Switch; Manuf_2: Panasonic; Manuf_Part_2: EVQP2B02B; Manuf_Part_1: C-TS-02H-2.5-B-V-T/R; Manuf_1: Jiubaba; Ordered by: Subcon; Fitted: YES; ECCN_US/EU: n/a
B2 = SW-PUSH-CMS_EVQP2_BLACK: EVQP2 - 4.7mm x 3.5 mm SMD Light Touch Switch; Manuf_2: Panasonic; Manuf_Part_2: EVQP2F02K; Manuf_1: Jiubaba; Manuf_Part_1: C-TS-02H-2.5-K-V-T/R; Ordered by: Subcon; Fitted: YES; ECCN_US/EU: n/a
C86 = Cap_100nF_X7R_10%_0402: as C1 on sheet ST_LINK_V2-1; Revision: July-2002: Re-released for DXP Platform.; Value: 100nF; Order: CC0402KRX7R7BB104; Manuf_1: YAGEO; ECCN_US/EU: n/a
C87 = Cap_100nF_X7R_10%_0402: Capacitor,100nF,16V,X7R,10%,0402,YAGEO; Manuf_Part_1: CC0402KRX7R7BB104; Ordered by: Subcon; Revision: July-2002: Re-released for DXP Platform.; Value: 100nF; Order: CC0402KRX7R7BB104; Manuf_1: YAGEO; ECCN_US/EU: n/a
C92 = Cap_1uF_X5R_10%_0603: as C3 on sheet ST_LINK_V2-1; Revision: July-2002: Re-released for DXP Platform.; Value: 1uF; Order: CC0603KRX5R7BB105; Manuf_1: YAGEO; ECCN_US/EU: n/a
CN14 = Header 4X2F: Header Female, 4-Pin, Dual row, Straight; Manuf_Part_1: BL 2-8G; Manuf_1: Fischer Electronik; Fitted: YES; Ordered by: Subcon; Distrib: Sub Co; Footprint: HDR2X4H; ECCN_US/EU: n/a
LD5 = LED_red: as LD2 on sheet ST_LINK_V2-1; Order: 19-213-R6C-AP1Q2B/3T; ECCN_US/EU: n/a
LD6 = LED_green: LED green 0603; Manuf_1: everlight; Manuf_Part_1: 19-213SYGC/S530-E2/TR8; Ordered by: Subcon; Fitted: YES; Order: 19-213SYGC/S530-E2/TR8; ECCN_US/EU: n/a
P1 = Header 10X2 TH RA 2mm: 20 Position Receptacle Connector 0.079" (2.00mm) Through Hole Right Angle; Manuf_1: Samtec; Manuf_2: ATOM; Manuf_Part_2: FH200210C-12000; Ordered by: Subcon; Fitted: YES; Manuf_Part_1: SQT-110-01-F-D-RA; Order: SQT-110-01-F-D-RA; Value: SQT-110-01-F-D-RA; ECCN_US/EU: n/a
P2 = Header 6X2 TH RA 2.54mm: 12 Position Receptacle Connector 0.100" (2.54mm) Through Hole Right Angle; Manuf_1: Samtec; Manuf_2: ATOM; Manuf_Part_2: FH254206C-1600; Ordered by: Subcon; Fitted: YES; Manuf_Part_1: SSW-106-02-F-D-RA; Order: SSW-106-02-F-D-RA; Value: SSW-106-02-F-D-RA; ECCN_US/EU: n/a
R29 R89 R90 R93-R96 R102 = Res_10K_1%_0402: as R11 on sheet ST_LINK_V2-1; Value: 10K; Manuf_1: YAGEO; Order: RC0402FR-0710KL; ECCN_US/EU: n/a
R47 = Res_1K_1%_0603: Resistor,1K,0603,1%,YAGEO; Manuf_Part_1: RC0603FR-071KL; Ordered by: Subcon; Fitted: YES; Manuf_1: YAGEO; Order: RC0603FR-071KL; ECCN_US/EU: n/a
R48 = Res_510_1%_0603: Resistor,510,0603,1%,YAGEO; Manuf_Part_1: RC0603FR-07510RL; Manuf_Part_2: RT0603FRE07510RL; Ordered by: Subcon; Fitted: YES; ECCN_US/EU: n/a; Manuf_1: YAGEO; Distrib: FARNELL; Manuf_2: YAGEO
R91 = Res_10K_1%_0402: as R19 on sheet ST_LINK_V2-1; Value: 10K; Manuf_1: YAGEO; Order: RC0402FR-0710KL; ECCN_US/EU: n/a
R92 R97 = Res_1K_1%_0402: as R1 on sheet ST_LINK_V2-1; Value: 1K; Manuf_1: YAGEO; Order: RC0402FR-071KL; ECCN_US/EU: n/a
SB25 SB27-SB29 SB33 SB34 = SB_ON: Fitted: YES; Ordered by: Subcon; Revision: July-2002: Re-released for DXP Platform.; ECCN_US/EU: n/a
U20 = STG3692QTR: Low voltage high bandwidth quad SPDT switch; Manuf_1: STM; Fitted: YES; ECCN_US/EU: EAR99/NEC; Ordered by: ST; Manuf_Part_1: STG3692QTR; Value: STG3692QTR